# Altium schematic sheet Sheet1.SchDoc
size 420 x 297 mm; Razrabotal: {Разработал}; Prov: {Проверил}; Tkont: {Т. конт.}; Nkont: {Н. конт.}; Utv: {Утвердил}; Naimenovanie: {Наименование}; Oboznachenie: {Обозначение}; Shifr: {Шифр}
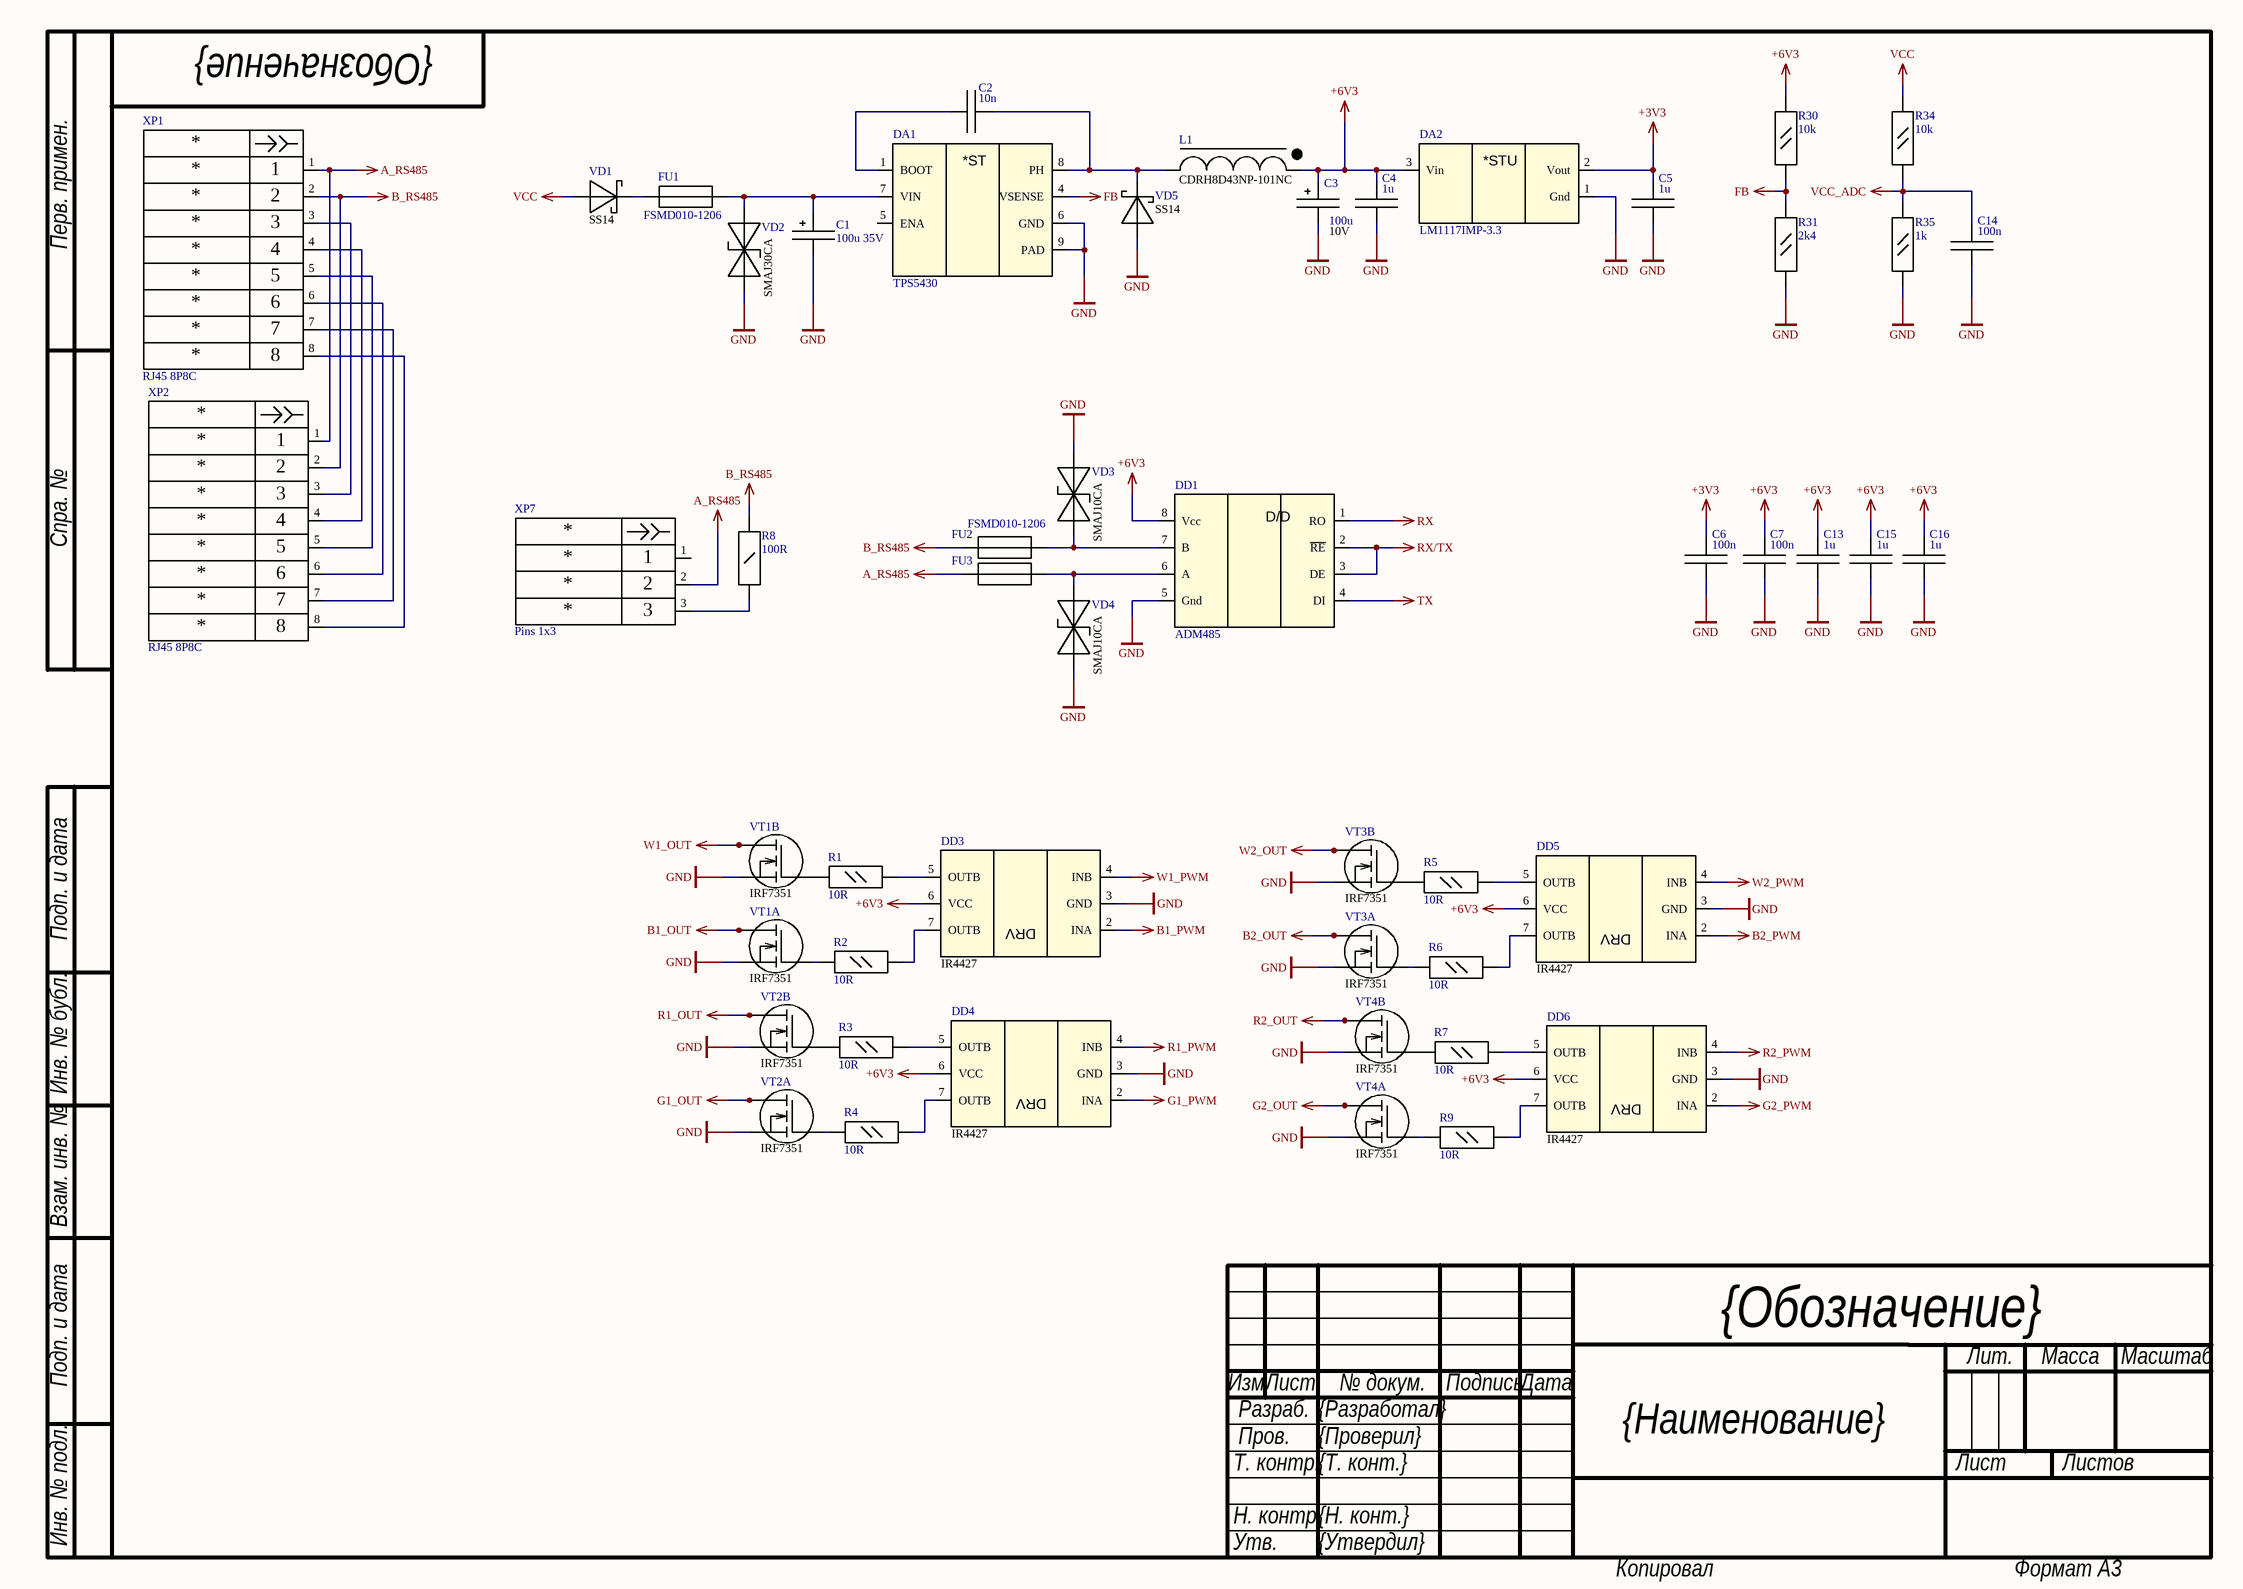
[diagram p0: Sheet1.SchDoc]

## Parts
C1  100u 35V  [Cap electro d6.3x2.54mm]
C2  10n  [Cap Ceramic 0805]
C3  100u  Comments: 10V  [TECap D]
C4  1u  [Cap Ceramic 0805]
C5  1u  [Cap Ceramic 0805]
C6  100n  [Cap Ceramic 0805]
C7  100n  [Cap Ceramic 0805]
C13  1u  [Cap Ceramic 0805]
C14  100n  [Cap Ceramic 0805]
C15  1u  [Cap Ceramic 0805]
C16  1u  [Cap Ceramic 0805]
DA1  TPS5430  [SO8 S1.27W6.00 GP]
DA2  LM1117IMP-3.3  [SOT-232]
DD1  ADM485  [SO8 S1.27W6.00]
DD3  IR4427  [SO8 S1.27W6.00]
DD4  IR4427  [SO8 S1.27W6.00]
DD5  IR4427  [SO8 S1.27W6.00]
DD6  IR4427  [SO8 S1.27W6.00]
FU1  FSMD010-1206  [Fuse 1206]
FU2  FSMD010-1206  [Fuse 1206]
FU3  FSMD010-1206  [Fuse 1206]  (value not drawn)
L1  CDRH8D43NP-101NC  [CDRH8D43NP-xxxNC]
R1  10R  [Resistor 0805]
R2  10R  [Resistor 0805]
R3  10R  [Resistor 0805]
R4  10R  [Resistor 0805]
R5  10R  [Resistor 0805]
R6  10R  [Resistor 0805]
R7  10R  [Resistor 0805]
R8  100R  [Resistor 1206]
R9  10R  [Resistor 0805]
R30  10k  [Resistor 0805]
R31  2k4  [Resistor 0805]
R34  10k  [Resistor 0805]
R35  1k  [Resistor 0805]
VD1  SS14  [DO-214AC SMA]
VD2  SMAJ30CA  [DO-214AC SMA]
VD3  SMAJ10CA  [DO-214AC SMA]
VD4  SMAJ10CA  [DO-214AC SMA]
VD5  SS14  [DO-214AC SMA]
VT1  IRF7351  [SO8 S1.27W6.00]  (parts A,B of 2)
VT2  IRF7351  [SO8 S1.27W6.00]  (parts A,B of 2)
VT3  IRF7351  [SO8 S1.27W6.00]  (parts A,B of 2)
VT4  IRF7351  [SO8 S1.27W6.00]  (parts A,B of 2)
XP1  RJ45 8P8C  [RJ45 8P8C]
XP2  RJ45 8P8C  [RJ45 8P8C]
XP7  Pins 1x3  [Pins 1x3]

## Nets
+3V3: C5.2 C6.2 DA2.2(Vout)
+6V3: C3.2 C4.2 C7.2 C13.2 C15.2 C16.2 DA2.3(Vin) DD1.8(Vcc) DD3.6(VCC) DD4.6(VCC) DD5.6(VCC) DD6.6(VCC) L1.1 R30.1
A_RS485: FU3.1 XP1.1 XP2.1 XP7.2
B1_OUT: VT1.7(D1) VT1.8(D1)
B1_PWM: DD3.2(INA)
B2_OUT: VT3.7(D1) VT3.8(D1)
B2_PWM: DD5.2(INA)
B_RS485: FU2.1 R8.2 XP1.2 XP2.2
FB: DA1.4(VSENSE) R30.2 R31.1
G1_OUT: VT2.7(D1) VT2.8(D1)
G1_PWM: DD4.2(INA)
G2_OUT: VT4.7(D1) VT4.8(D1)
G2_PWM: DD6.2(INA)
GND: C1.1 C3.1 C4.1 C5.1 C6.1 C7.1 C13.1 C14.1 C15.1 C16.1 DA1.6(GND) DA1.9(PAD) DA2.1(Gnd) DD1.5(Gnd) DD3.3(GND) DD4.3(GND) DD5.3(GND) DD6.3(GND) R31.2 R35.2 VD2.1 VD3.1 VD4.1 VD5.1(A) VT1.1(S1) VT1.3(S2) VT2.1(S1) VT2.3(S2) VT3.1(S1) VT3.3(S2) VT4.1(S1) VT4.3(S2)
R1_OUT: VT2.5(D1) VT2.6(D1)
R1_PWM: DD4.4(INB)
R2_OUT: VT4.5(D1) VT4.6(D1)
R2_PWM: DD6.4(INB)
RX: DD1.1(RO)
RX/TX: DD1.2(~{RE}) DD1.3(DE)
TX: DD1.4(DI)
VCC: R34.1 VD1.1(A)
VCC_ADC: C14.2 R34.2 R35.1
W1_OUT: VT1.5(D1) VT1.6(D1)
W1_PWM: DD3.4(INB)
W2_OUT: VT3.5(D1) VT3.6(D1)
W2_PWM: DD5.4(INB)
NetC1_2: C1.2 DA1.7(VIN) FU1.2 VD2.2
NetC2_1: C2.1 DA1.1(BOOT)
NetC2_2: C2.2 DA1.8(PH) L1.2 VD5.2(K)
NetDD1_6: DD1.6(A) FU3.2 VD4.2
NetDD1_7: DD1.7(B) FU2.2 VD3.2
NetDD3_5: DD3.5(OUTB) R1.2
NetDD3_7: DD3.7(OUTB) R2.2
NetDD4_5: DD4.5(OUTB) R3.2
NetDD4_7: DD4.7(OUTB) R4.2
NetDD5_5: DD5.5(OUTB) R5.2
NetDD5_7: DD5.7(OUTB) R6.2
NetDD6_5: DD6.5(OUTB) R7.2
NetDD6_7: DD6.7(OUTB) R9.2
NetFU1_1: FU1.1 VD1.2(K)
NetR1_1: R1.1 VT1.4(G2)
NetR2_1: R2.1 VT1.2(G1)
NetR3_1: R3.1 VT2.4(G2)
NetR4_1: R4.1 VT2.2(G1)
NetR5_1: R5.1 VT3.4(G2)
NetR6_1: R6.1 VT3.2(G1)
NetR7_1: R7.1 VT4.4(G2)
NetR8_1: R8.1 XP7.3
NetR9_1: R9.1 VT4.2(G1)
NetXP1_3: XP1.3 XP2.3
NetXP1_4: XP1.4 XP2.4
NetXP1_5: XP1.5 XP2.5
NetXP1_6: XP1.6 XP2.6
NetXP1_7: XP1.7 XP2.7
NetXP1_8: XP1.8 XP2.8

Not connected (* = marked no-connect by the designer): DA1 2(NC) 3(NC) 5(ENA); XP7 1

## Notes on the sheet
- Перв. примен.
- Спра. №
- Подп. и дата
- Инв. № бубл.
- Взам. инв. №
- Изм
- Лист
- № докум.
- Подпись
- Дата
- Лит.
- Масса
- Масштаб
- Т. контр.
- Разраб.
- Пров.
- Листов
- Инв. № подл.
- Н. контр.
- Утв.
- Копировал
- Формат А3
- (in symbol ADM485) D/D
- (in symbol IR4427) DRV
- (in symbol LM1117IMP-x.x) *STU
- (in symbol TPS5430) *ST

## Library data of the parts
C1 = ECap: Comments: *
C2 C4-C7 C13-C16 = CerCap: Comments: *
C3 = TECap
DA2 = LM1117IMP-x.x: Comments: *
FU1-FU3 = FSMDxxx-1206: Comments: *
L1 = CDRH8D43NP-xxxNC
R1-R7 R9 R30 R31 R34 R35 = Resistor 0,125W: Comments: *
R8 = Resistor 0,25W: Comments: *
VD2-VD4 = SMAJxxCA: Comments: *
DA1 = TPS5430: Comments: *
DD1 = ADM485: Comments: *
VD1 VD5 = SS14: Comments: *
XP1 XP2 = RJ45 8P8C: Comments: *; Name1: *; Name2: *; Name3: *; Name: *; Name4: *; Name5: *; Name6: *; Name7: *; Name8: *
XP7 = Pins 1x3: Comments: *; Name1: *; Name: *; Name2: *; Name3: *